# EAGLE schematic Voltage Divider (EAGLE 7.5.0)
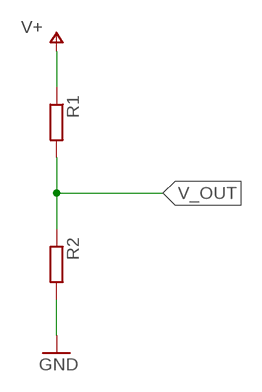
[diagram p0: schematic, sheet 1]

## Parts
R1  R-EU_R0805  [R0805]
R2  R-EU_R0805  [R0805]

## Nets
GND: R2.2
V+: R1.1
V_OUT: R1.2 R2.1

## Library data of the parts
R1 R2 = rcl:R-EU_: RESISTOR, European symbol